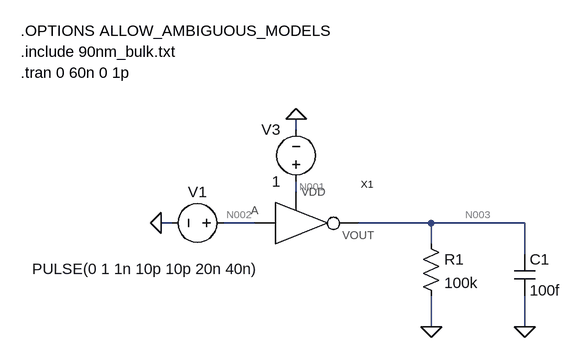
[diagram p0: schematic not_tests.asc]
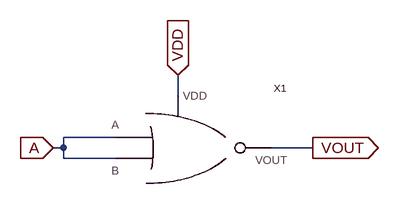
[diagram p1: sub-circuit not.asc]
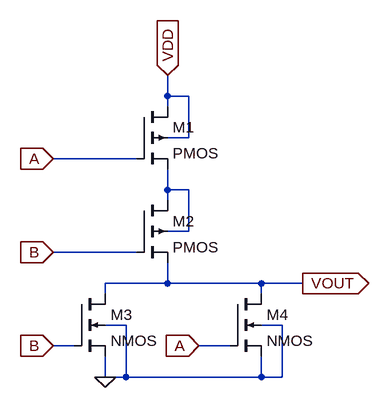
[diagram p2: sub-circuit nor.asc]
not_tests.asc, the LTspice schematic file:
Version 4.1
SHEET 1 880 680
WIRE 256 96 256 80
WIRE 256 192 256 176
WIRE 64 240 48 240
WIRE 192 240 144 240
WIRE 464 240 352 240
WIRE 608 240 464 240
WIRE 464 272 464 240
WIRE 608 288 608 240
WIRE 464 400 464 352
WIRE 608 400 608 352
FLAG 608 400 0
FLAG 464 400 0
FLAG 256 80 0
FLAG 48 240 0
SYMBOL voltage 256 192 R180
WINDOW 0 24 96 Left 2
WINDOW 3 24 16 Left 2
WINDOW 123 0 0 Left 0
WINDOW 39 0 0 Left 0
SYMATTR InstName V3
SYMATTR Value 1
SYMBOL res 448 256 R0
SYMATTR InstName R1
SYMATTR Value 100k
SYMBOL cap 592 288 R0
SYMATTR InstName C1
SYMATTR Value 100f
SYMBOL voltage 160 240 R90
WINDOW 0 -32 56 VBottom 2
WINDOW 3 55 135 VTop 2
WINDOW 123 0 0 Left 0
WINDOW 39 0 0 Left 0
SYMATTR InstName V1
SYMATTR Value PULSE(0 1 1n 10p 10p 20n 40n)
SYMBOL not 256 240 R0
SYMATTR InstName X1
TEXT -168 -24 Left 2 !.include 90nm_bulk.txt
TEXT -168 8 Left 2 !.tran 0 60n 0 1p
TEXT -168 -56 Left 2 !.OPTIONS ALLOW_AMBIGUOUS_MODELS

not.asc, the sub-circuit schematic file:
Version 4.1
SHEET 1 880 680
WIRE 224 96 224 64
WIRE 128 160 48 160
WIRE 48 176 48 160
WIRE 48 176 32 176
WIRE 432 176 368 176
WIRE 48 192 48 176
WIRE 128 192 48 192
FLAG 224 64 VDD
IOPIN 224 64 In
FLAG 32 176 A
IOPIN 32 176 In
FLAG 432 176 VOUT
IOPIN 432 176 Out
SYMBOL nor 240 176 R0
SYMATTR InstName X1

nor.asc, the sub-circuit schematic file:
Version 4.1
SHEET 1 1028 680
WIRE 272 80 272 48
WIRE 304 80 272 80
WIRE 272 96 272 80
WIRE 304 144 304 80
WIRE 304 144 272 144
WIRE 224 176 96 176
WIRE 272 224 272 192
WIRE 304 224 272 224
WIRE 272 240 272 224
WIRE 304 288 304 224
WIRE 304 288 272 288
WIRE 224 320 96 320
WIRE 272 368 272 336
WIRE 272 368 176 368
WIRE 416 368 272 368
WIRE 480 368 416 368
WIRE 176 384 176 368
WIRE 416 384 416 368
WIRE 208 432 176 432
WIRE 448 432 416 432
WIRE 128 464 96 464
WIRE 368 464 320 464
WIRE 176 512 176 480
WIRE 208 512 208 432
WIRE 208 512 176 512
WIRE 416 512 416 480
WIRE 416 512 208 512
WIRE 448 512 448 432
WIRE 448 512 416 512
FLAG 96 176 A
IOPIN 96 176 In
FLAG 272 48 VDD
IOPIN 272 48 In
FLAG 96 320 B
IOPIN 96 320 In
FLAG 480 368 VOUT
IOPIN 480 368 Out
FLAG 176 512 0
FLAG 320 464 A
IOPIN 320 464 In
FLAG 96 464 B
IOPIN 96 464 In
SYMBOL pmos4 224 96 R0
SYMATTR InstName M1
SYMATTR Value2 l=90n w=400n
SYMBOL pmos4 224 240 R0
SYMATTR InstName M2
SYMATTR Value2 l=90n w=400n
SYMBOL nmos4 368 384 R0
SYMATTR InstName M4
SYMATTR Value2 l=90n w=200n
SYMBOL nmos4 128 384 R0
SYMATTR InstName M3
SYMATTR Value2 l=90n w=200n

The netlist it stands for:
* not_tests.asc
V3 N001 0 1
R1 N003 0 100k
C1 N003 0 100f
V1 N002 0 PULSE(0 1 1n 10p 10p 20n 40n)
X§X1 N001 N002 N003 not

* block symbol definitions
.subckt not VDD A VOUT
X§X1 A A VDD VOUT nor
.ends not

.subckt nor A B VDD VOUT
M1 VDD A N001 VDD PMOS l=90n w=400n
M2 N001 B VOUT N001 PMOS l=90n w=400n
M4 VOUT A 0 0 NMOS l=90n w=200n
M3 VOUT B 0 0 NMOS l=90n w=200n
.ends nor

.model NMOS NMOS
.model PMOS PMOS
.lib standard.mos
.include 90nm_bulk.txt
.tran 0 60n 0 1p
.OPTIONS ALLOW_AMBIGUOUS_MODELS
.backanno
.end

* Results of the author's LTspice run, read from the files saved beside the schematic
* Operating Point, zero values left out:
*   V(n001) = 1 V
*   V(n003) = 800 mV
*   I(R1) = 8 µA
*   I(V3) = -8 µA
*   Ix(x1:vdd) = 8 µA
*   Ix(x1:vout) = -8 µA
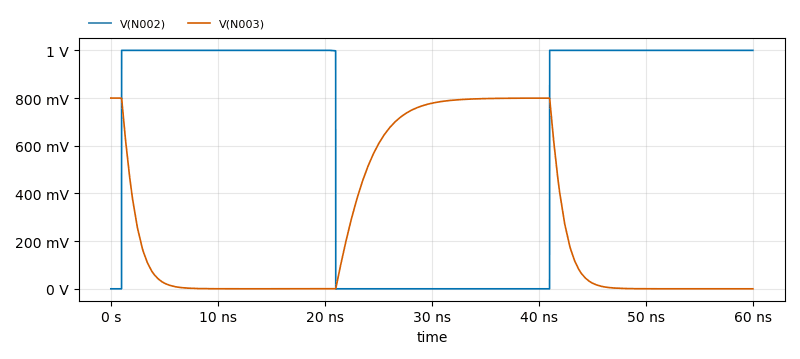
[diagram p3: Transient Analysis of not_tests.asc, plotted from the saved traces]
* Transient Analysis, 1 run:
*   V(N002): min 0 V, max 1 V, average 650.1 mV, rms 806.2 mV, last 1 V
*   V(N003): min 0 V, max 800 mV, average 276.4 mV, rms 442 mV, last 0 V